# EAGLE design octave-fuzz (EAGLE 7.6.0)
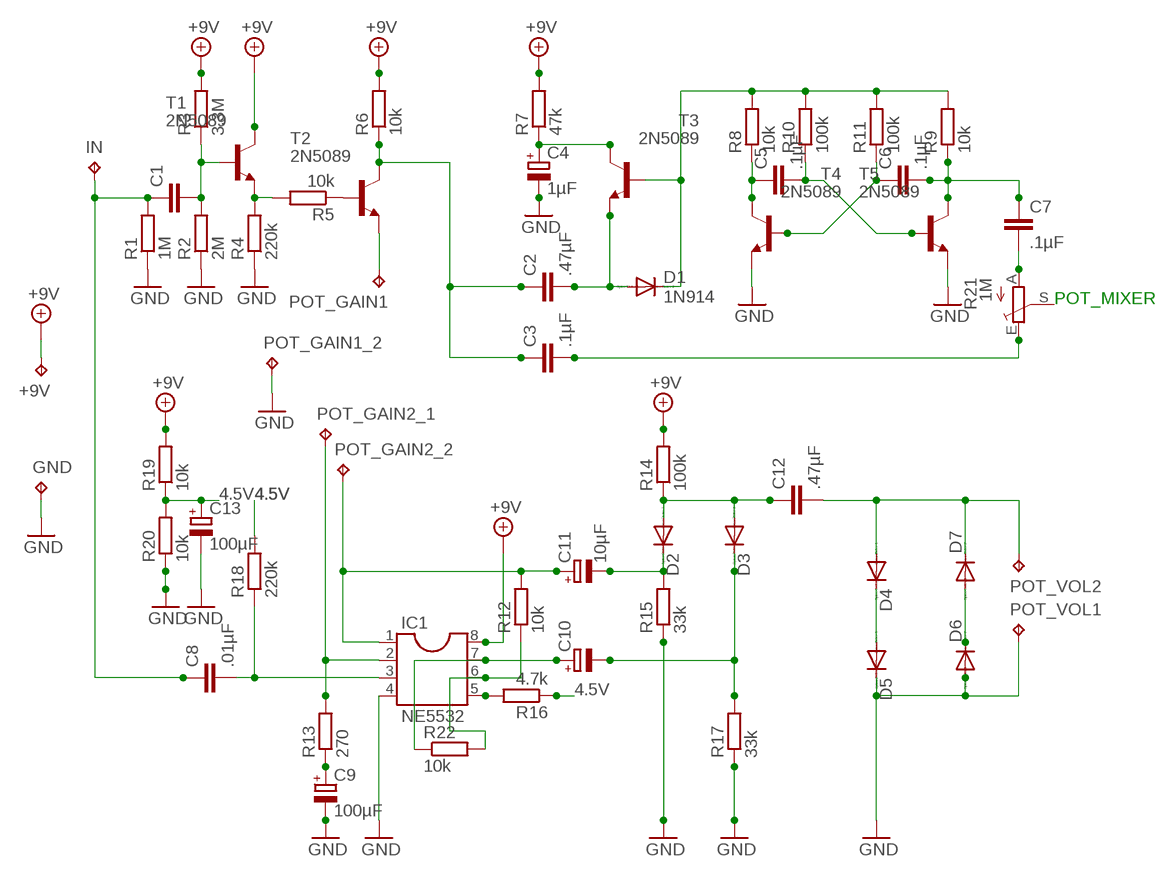
[diagram p0: schematic, sheet 1]

## Parts
+9V  TPPAD1-20Y  [P1-20Y]
C1  C-EU050-025X075  [C050-025X075]
C2  .47µF  C-EU050-025X075  [C050-025X075]
C3  .1µF  C-EU050-025X075  [C050-025X075]
C4  1µF  CPOL-EUE3.5-8  [E3,5-8]
C5  .1µF  C-EU050-025X075  [C050-025X075]
C6  .1µF  C-EU050-025X075  [C050-025X075]
C7  .1µF  C-EU050-025X075  [C050-025X075]
C8  .01µF  C-EU050-025X075  [C050-025X075]
C9  100µF  CPOL-EUE3.5-8  [E3,5-8]
C10  CPOL-EUE3.5-8  [E3,5-8]
C11  10µF  CPOL-EUE3.5-8  [E3,5-8]
C12  .47µF  C-EU050-025X075  [C050-025X075]
C13  100µF  CPOL-EUE3.5-8  [E3,5-8]
D1  1N914  DIODE-D-12.5  [D-12.5]
D2  DIODE-D-12.5  [D-12.5]
D3  DIODE-D-12.5  [D-12.5]
D4  DIODE-D-12.5  [D-12.5]
D5  DIODE-D-12.5  [D-12.5]
D6  DIODE-D-12.5  [D-12.5]
D7  DIODE-D-12.5  [D-12.5]
GND  TPPAD1-20Y  [P1-20Y]
IC1  NE5532  DIL8  [DIL08]
IN  TPPAD1-17Y  [P1-17Y]
POT_GAIN1  TPPAD1-20Y  [P1-20Y]
POT_GAIN1_2  TPPAD1-20Y  [P1-20Y]
POT_GAIN2_1  TPPAD1-20Y  [P1-20Y]
POT_GAIN2_2  TPPAD1-20Y  [P1-20Y]
POT_VOL1  TPPAD1-20Y  [P1-20Y]
POT_VOL2  TPPAD1-20Y  [P1-20Y]
R1  1M  R-EU_0207/10  [0207/10]
R2  2M  R-EU_0207/10  [0207/10]
R3  3.3M  R-EU_0207/10  [0207/10]
R4  220k  R-EU_0207/10  [0207/10]
R5  10k  R-EU_0207/10  [0207/10]
R6  10k  R-EU_0207/10  [0207/10]
R7  47k  R-EU_0207/10  [0207/10]
R8  10k  R-EU_0207/10  [0207/10]
R9  10k  R-EU_0207/10  [0207/10]
R10  100k  R-EU_0207/10  [0207/10]
R11  100k  R-EU_0207/10  [0207/10]
R12  10k  R-EU_0207/10  [0207/10]
R13  270  R-EU_0207/10  [0207/10]
R14  100k  R-EU_0207/10  [0207/10]
R15  33k  R-EU_0207/10  [0207/10]
R16  4.7k  R-EU_0207/10  [0207/10]
R17  33k  R-EU_0207/10  [0207/10]
R18  220k  R-EU_0207/10  [0207/10]
R19  10k  R-EU_0207/10  [0207/10]
R20  10k  R-EU_0207/10  [0207/10]
R21  1M  TRIM_EU-CA9V  [CA9V]
R22  10k  R-EU_0207/10  [0207/10]
T1  2N5089  [TO92]
T2  2N5089  [TO92]
T3  2N5089  [TO92]
T4  2N5089  [TO92]
T5  2N5089  [TO92]

## Nets
4.5V: C13.+ R16.1 R18.2 R19.1 R20.2
+9V: +9V.TP IC1.8 R3.2 R6.2 R7.2 R14.2 R19.2 T1.1(C)
GND: C4.- C9.- C13.- D5.C D6.A GND.TP IC1.4 POT_GAIN1_2.TP POT_VOL1.TP R1.1 R2.1 R4.1 R15.1 R17.1 R20.1 T4.3(E) T5.3(E)
N$1: C1.1 C8.1 IN.TP R1.2
N$2: C1.2 R2.2 R3.1 T1.2(B)
N$3: R4.2 R5.2 T1.3(E)
N$4: R5.1 T2.2(B)
N$5: C2.1 C3.1 R6.1 T2.1(C)
N$6: POT_GAIN1.TP T2.3(E)
N$7: C4.+ R7.1 T3.1(C)
N$8: C2.2 D1.A T3.3(E)
N$9: C5.1 R8.1 T4.1(C)
N$10: C8.2 IC1.3 R18.1
N$11: C3.2 R21.E
N$12: C7.2 R21.A
N$13: C6.1 R11.1 T4.2(B)
N$14: D1.C R8.2 R9.2 R10.2 R11.2 T3.2(B)
N$18: IC1.2 POT_GAIN2_1.TP R13.2
N$19: C9.+ R13.1
N$20: C11.+ IC1.1 POT_GAIN2_2.TP R12.2
N$21: IC1.6 R12.1 R22.2
N$22: C10.+ IC1.7 R22.1
N$23: IC1.5 R16.2
N$24: D4.C D5.A
N$25: D6.C D7.A
N$26: C12.2 D4.A D7.C POT_VOL2.TP
N$27: C10.- D3.C R17.2
N$28: C12.1 D2.A D3.A R14.1
N$29: C11.- D2.C R15.2
N$30: C6.2 C7.1 R9.1 T5.1(C)
N$31: C5.2 R10.1 T5.2(B)
Unconnected: R21.S

## Notes on the sheet
- POT_MIXER

## Library data of the parts
+9V GND IN POT_GAIN1 POT_GAIN1_2 POT_GAIN2_1 POT_GAIN2_2 POT_VOL1 POT_VOL2 = testpad:TP: Test pad
C1-C3 C5-C8 C12 = rcl:C-EU: CAPACITOR, European symbol
C4 C9-C11 C13 = rcl:CPOL-EU: POLARIZED CAPACITOR, European symbol
D1-D7 = diode:DIODE-: DIODE
IC1 = ic-package:DIL8: Dual In Line / Socket
R1-R20 R22 = resistor:R-EU_: RESISTOR, European symbol
R21 = pot:TRIM_EU-: POTENTIOMETER
T1-T5 = transistor:2N5089: NPN TRANSISTOR

## Board
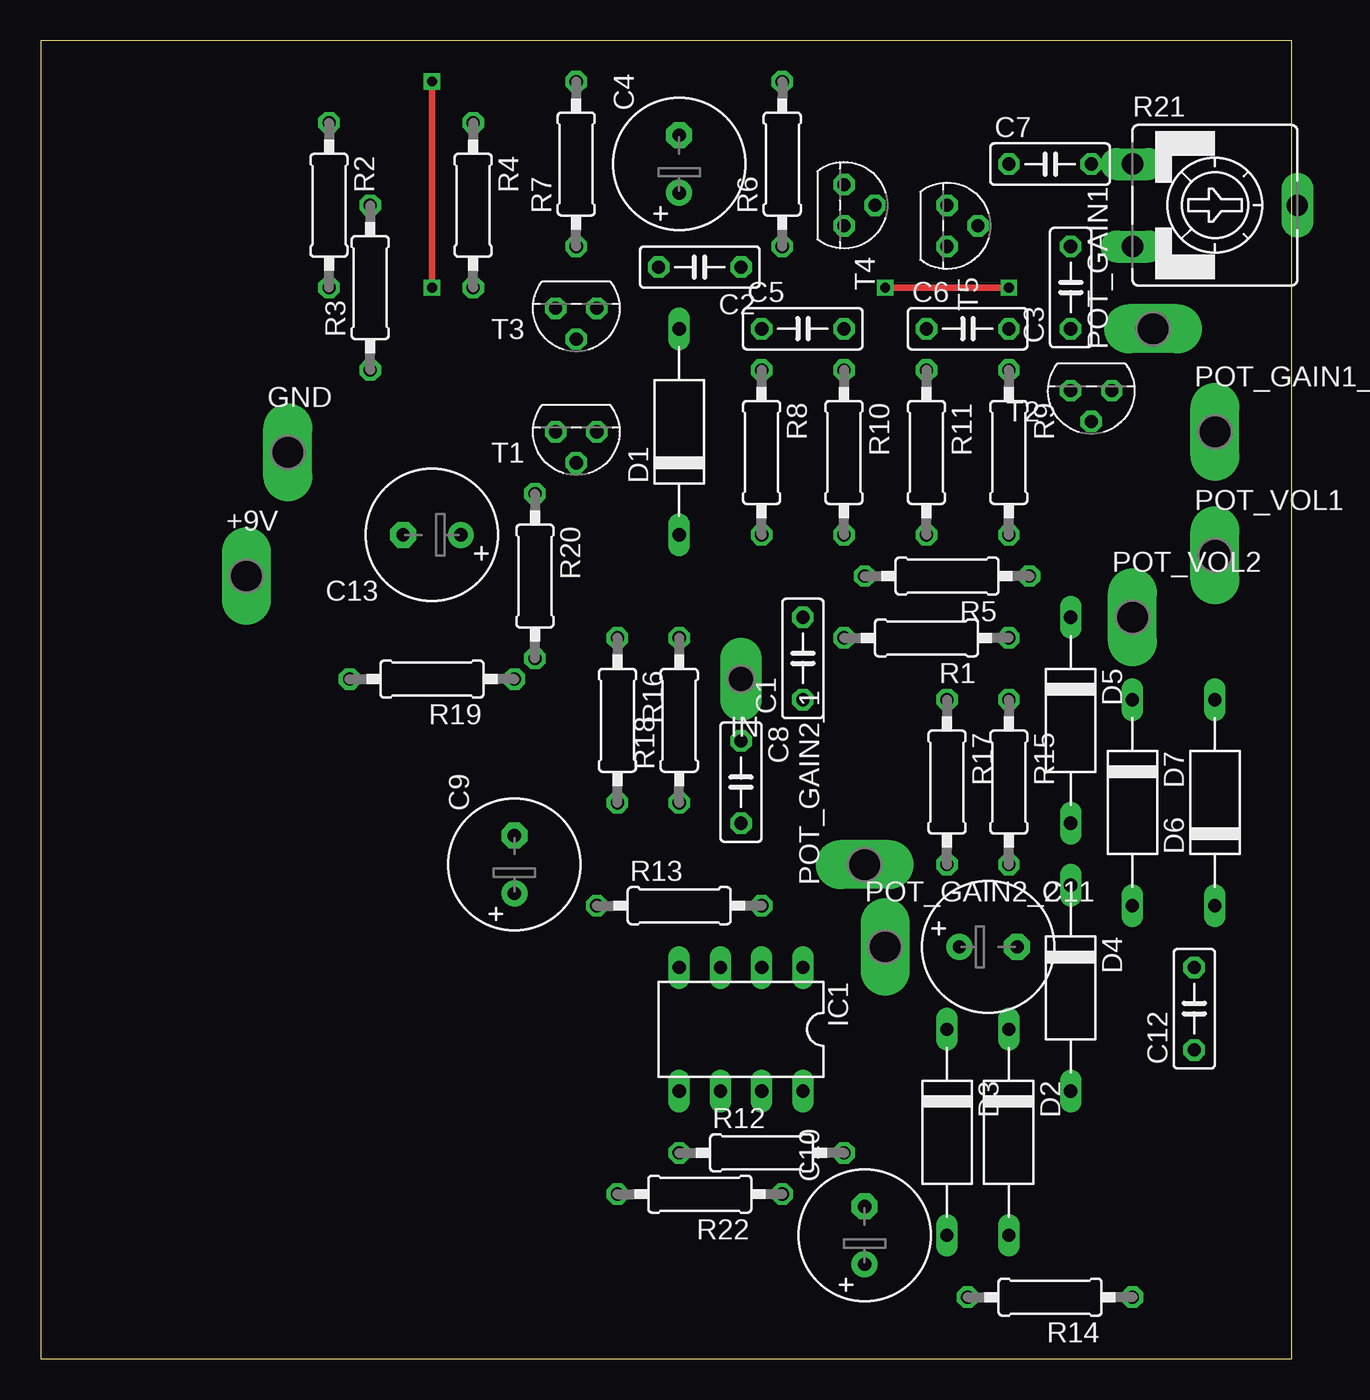
[diagram p1: board, top side]
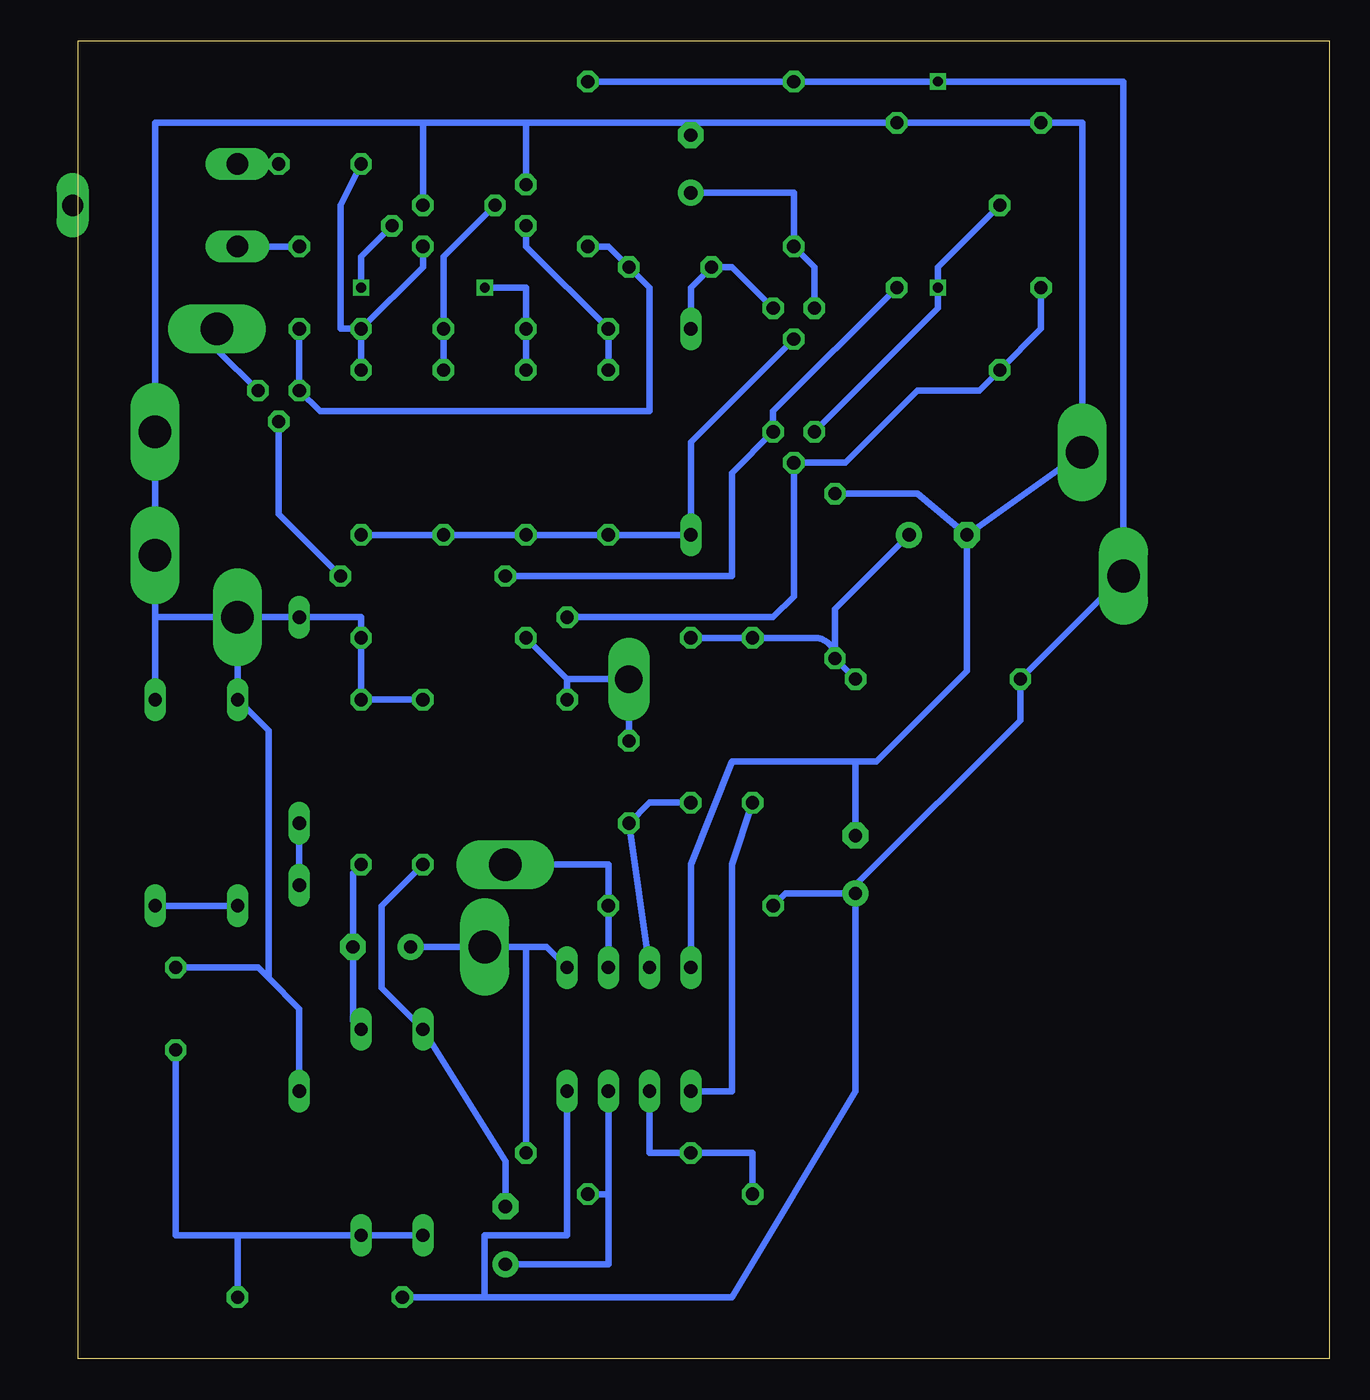
[diagram p2: board, bottom side, seen from below]

Size 77.14 x 81.27 mm. Coordinates in mm from the lower left corner, seen from the top.
Outline: 0,0 77.14,0 77.14,81.27 0,81.27 0,0
Copper layers (1*16): Top 0.035mm / dielectric 1.5mm / Bottom 0.035mm
Design rules "default": minimum track width 10mil, minimum drill 24mil, track to track 8mil, track to pad 8mil, pad to pad 8mil, via to via 8mil, smd to smd 8mil, copper to edge 40mil, drill to drill 8mil, minimum pad ring 10mil, minimum via ring 8mil, stop-mask expansion 4mil, vias tented up to drill 0mil, thermal gap 10mil

### Footprints (pad centres in the part's own frame; a part is rotated, then mirrored left to right if it is on the bottom)
P1-20Y = drill 2.007 pad 2.54 long: TP 0,0
C050-025X075 = drill 0.813 octagon: 1 -2.54,0; 2 2.54,0
E3,5-8 = drill 0.813 pad 1.6: + -1.778,0 | drill 0.813 pad 1.6 octagon: - 1.778,0
D-12.5 = drill 0.813 long: A 6.35,0; C -6.35,0
DIL08 = drill 0.813 long: 1 -3.81,-3.81; 2 -1.27,-3.81; 3 1.27,-3.81; 4 3.81,-3.81; 5 3.81,3.81; 6 1.27,3.81; 7 -1.27,3.81; 8 -3.81,3.81
P1-17Y = drill 1.702 pad 2.121 long: TP 0,0
0207/10 = drill 0.813 octagon: 1 -5.08,0; 2 5.08,0
CA9V = drill 1.321 long: A -2.54,-5.08; E 2.54,-5.08; S 0,5.08
TO92 = drill 0.813 octagon: 1 1.27,0; 2 0,1.905; 3 -1.27,0

### Placement (x,y rotation side)
+9V  12.7,48.26 0 top
C1  46.99,43.18 90 top
C2  40.64,67.31 180 top
C3  63.5,66.04 90 top
C4  39.37,73.66 90 top
C5  46.99,63.5 0 top
C6  57.15,63.5 0 top
C7  62.23,73.66 0 top
C8  43.18,35.56 270 top
C9  29.21,30.48 90 top
C10  50.8,7.62 90 top
C11  58.42,25.4 0 top
C12  71.12,21.59 90 top
C13  24.13,50.8 180 top
D1  39.37,57.15 90 top
D2  59.69,13.97 270 top
D3  55.88,13.97 270 top
D4  63.5,22.86 270 top
D5  63.5,39.37 270 top
D6  72.39,34.29 90 top
D7  67.31,34.29 270 top
GND  15.24,55.88 0 top
IC1  43.18,20.32 180 top
IN  43.18,41.91 180 top
POT_GAIN1  68.58,63.5 90 top
POT_GAIN1_2  72.39,57.15 0 top
POT_GAIN2_1  50.8,30.48 90 top
POT_GAIN2_2  52.07,25.4 0 top
POT_VOL1  72.39,49.53 0 top
POT_VOL2  67.31,45.72 0 top
R1  54.61,44.45 180 top
R2  17.78,71.12 270 top
R3  20.32,66.04 90 top
R4  26.67,71.12 270 top
R5  55.88,48.26 180 top
R6  45.72,73.66 90 top
R7  33.02,73.66 90 top
R8  44.45,55.88 270 top
R9  59.69,55.88 270 top
R10  49.53,55.88 270 top
R11  54.61,55.88 270 top
R12  44.45,12.7 0 top
R13  39.37,27.94 0 top
R14  62.23,3.81 180 top
R15  59.69,35.56 270 top
R16  35.56,39.37 270 top
R17  55.88,35.56 270 top
R18  39.37,39.37 90 top
R19  24.13,41.91 180 top
R20  30.48,48.26 270 top
R21  72.39,71.12 270 top
R22  40.64,10.16 180 top
T1  33.02,57.15 180 top
T2  64.77,59.69 180 top
T3  33.02,64.77 180 top
T4  49.53,71.12 270 top
T5  55.88,69.85 270 top

### Tracks (layer width: path | path; a pad name or v marks a point on that pad's centre or on a via)
4.5V
  Bottom 0.406: C13.+ 30.48,46.23 R20.2 | R18.2 R16.1 31.75,44.45 arc90 R20.2 | R19.1 R20.2
+9V  (via drill 0.6)
  Top 0.406: v24.13,66.04 v24.13,78.74
  Bottom 0.406: T1.1 24.13,64.77 v24.13,66.04 24.13,67.31 R3.2 | 52.07,3.81 36.83,3.81 29.21,16.51 29.21,29.21 19.05,39.37 R19.2 +9V.TP 12.7,78.74 v24.13,78.74 R7.2 R6.2 | 52.07,3.81 52.07,7.62 46.99,7.62 IC1.8 | 52.07,3.81 R14.2
GND
  Bottom 0.406: R4.1 39.37,76.2 | 39.37,76.2 49.53,76.2 | 49.53,76.2 55.88,76.2 | 55.88,76.2 72.39,76.2 POT_GAIN1_2.TP POT_VOL1.TP 72.39,45.72 | 29.97,76.2 R4.1 | R4.1 R2.1 15.24,76.2 GND.TP C13.- | R20.1 25.4,53.34 C13.- | D6.A 72.39,45.72 | R17.1 R15.1 R1.1 59.69,45.72 D5.C 72.39,45.72 | C4.- 39.37,76.2 | T4.3 49.53,76.2 | T5.3 55.88,76.2 | IC1.4 39.37,30.48 36.83,36.83 29.21,36.83 | 29.21,36.83 27.94,36.83 22.35,42.42 C13.- | C9.- 29.21,36.83
N$1
  Bottom 0.406: R1.2 46.99,41.91 | C8.1 IN.TP 46.99,41.91 | 46.99,41.91 C1.1
N$2
  Bottom 0.406: R2.2 17.78,63.5 R3.1 21.59,59.69 25.4,59.69 29.84,55.25 T1.2 33.02,46.99 34.29,45.72 C1.2
N$3
  Bottom 0.406: R5.2 36.83,48.26 36.83,54.61 T1.3 34.29,58.42 R4.2
N$4
  Bottom 0.406: R5.1 64.77,52.07 T2.2
N$5
  Bottom 0.406: C3.1 T2.1 62.23,58.42 41.91,58.42 41.91,66.04 C2.1 44.45,68.58 R6.1
N$6
  Bottom 0.406: POT_GAIN1.TP 68.58,62.23 T2.3
N$7
  Bottom 0.406: C4.+ 33.02,71.88 R7.1 31.75,67.31 T3.1
N$8
  Bottom 0.406: T3.3 36.83,67.31 C2.2 39.37,66.04 D1.A
N$9
  Bottom 0.406: T4.1 49.53,68.58 C5.1 R8.1
N$10
  Bottom 0.406: IC1.3 C8.2 41.91,34.29 R18.1
N$11
  Bottom 0.406: C3.2 R21.E
N$12
  Bottom 0.406: C7.2 R21.A
N$13
  Bottom 0.406: T4.2 54.61,67.94 C6.1 R11.1
N$14
  Bottom 0.406: R9.2 R11.2 R10.2 R8.2 D1.C 39.37,56.52 T3.2
N$18
  Bottom 0.406: IC1.2 R13.2 44.45,30.48 POT_GAIN2_1.TP
N$19
  Bottom 0.406: R13.1 33.53,28.7 C9.+
N$20
  Bottom 0.406: C11.+ POT_GAIN2_2.TP 49.53,25.4 | IC1.1 48.26,25.4 49.53,25.4 | R12.2 49.53,25.4
N$21
  Bottom 0.406: IC1.6 41.91,12.7 R12.1 35.56,12.7 R22.2
N$22
  Bottom 0.406: C10.+ 44.45,5.84 44.45,10.16 | 44.45,10.16 IC1.7 | R22.1 44.45,10.16
N$23
  Bottom 0.406: R16.2 36.83,30.48 36.83,16.51 IC1.5
N$24
  Bottom 0.406: D4.C D5.A
N$25
  Bottom 0.406: D6.C D7.A
N$26
  Bottom 0.406: POT_VOL2.TP D7.C 65.41,38.74 65.41,23.5 | D4.A 63.5,21.59 65.41,23.5 | 65.41,23.5 66.04,24.13 C12.2
N$27
  Bottom 0.406: C10.- 50.8,12.19 D3.C 58.42,22.86 58.42,27.94 R17.2
N$28
  Bottom 0.406: D3.A D2.A 67.31,7.62 | 67.31,7.62 71.12,7.62 C12.1 | R14.1 67.31,7.62
N$29
  Bottom 0.406: D2.C 60.2,20.83 C11.- 60.2,29.97 R15.2
N$30
  Bottom 0.406: R9.1 C6.2 | C7.1 60.96,71.12 60.96,63.5 C6.2 | T5.1 55.88,67.31 C6.2
N$31  (via drill 0.6)
  Top 0.406: v52.07,66.04 v59.69,66.04
  Bottom 0.406: T5.2 59.69,67.94 v59.69,66.04 | v52.07,66.04 49.53,66.04 C5.2 R10.1